# EAGLE design 32u4_pocket (EAGLE 7.4.0)
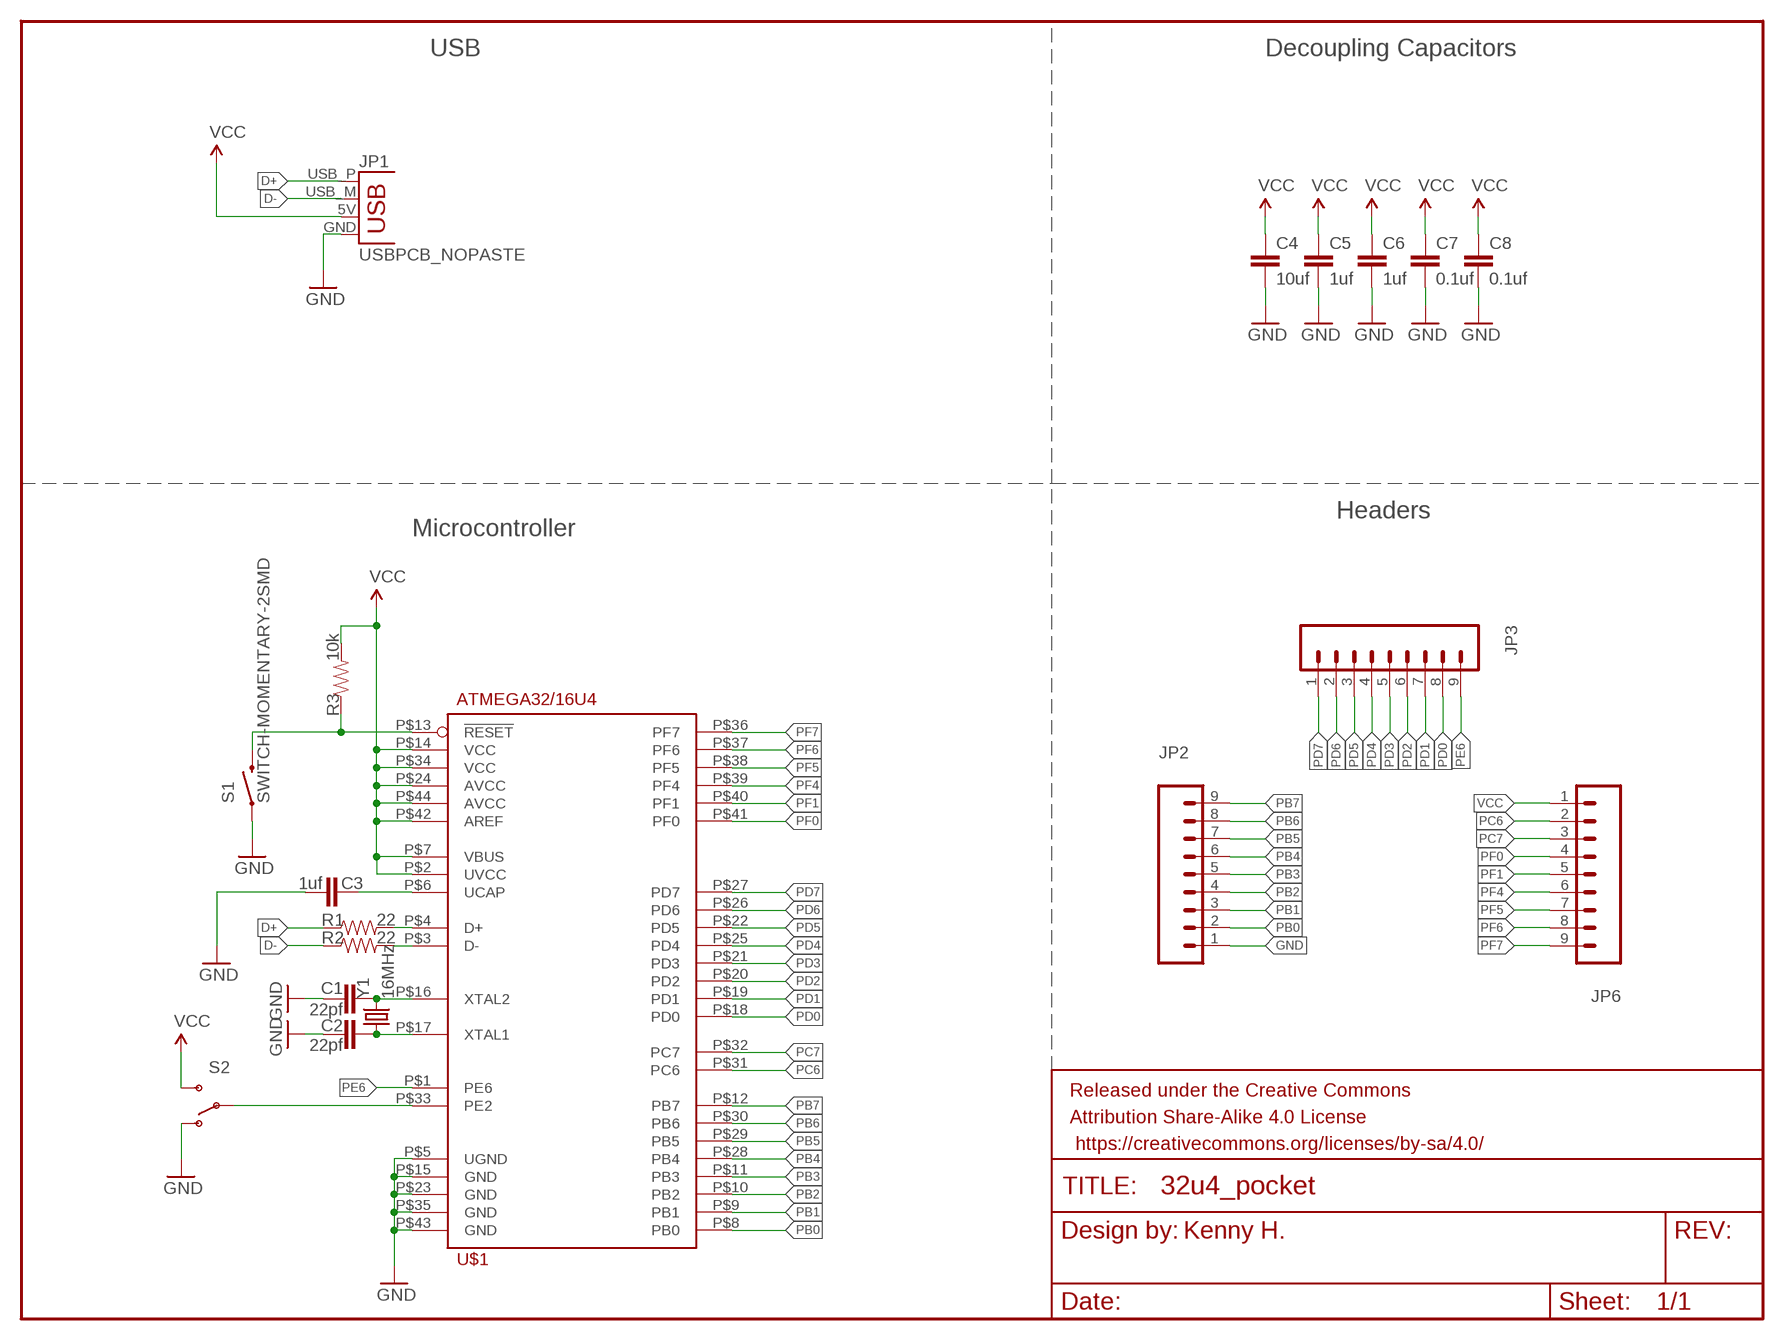
[diagram p0: schematic, sheet 1]

## Parts
C1  22pf  CAP0603-CAP  [0603-CAP]
C2  22pf  CAP0603-CAP  [0603-CAP]
C3  1uf  CAP0603-CAP  [0603-CAP]
C4  10uf  CAP0603-CAP  [0603-CAP]
C5  1uf  CAP0603-CAP  [0603-CAP]
C6  1uf  CAP0603-CAP  [0603-CAP]
C7  0.1uf  CAP0603-CAP  [0603-CAP]
C8  0.1uf  CAP0603-CAP  [0603-CAP]
FRAME1  FRAME-LETTER  [CREATIVE_COMMONS]
JP1  USBPCB_NOPASTE  [USB-A-PCB-NOPASTE]
JP2  M09LOCK-LONGPADS  [1X09_LOCK_LONGPADS]
JP3  M09LOCK-LONGPADS  [1X09_LOCK_LONGPADS]
JP6  M09LOCK-LONGPADS  [1X09_LOCK_LONGPADS]
R1  22  RESISTOR0603-RES  [0603-RES]
R2  22  RESISTOR0603-RES  [0603-RES]
R3  10k  RESISTOR0603-RES  [0603-RES]
S1  SWITCH-MOMENTARY-2SMD  [TACTILE-SWITCH-SMD]
S2  SWITCH-SPDT-SMD-A  [SWITCH-SPST-SMD-A]
U$1  ATMEGA32/16U4  [TQFP_44_0.8MM]
Y1  16MHz  CRYSTALHC49US  [HC49US]

## Nets
D+: JP1.USB_P(D+) R1.1
D-: JP1.USB_M(D-) R2.1
GND: C1.1 C2.1 C3.2 C4.2 C5.2 C6.2 C7.2 C8.2 JP1.GND JP2.1 S1.1 S2.1(O) U$1.P$5(UGND) U$1.P$15(GND) U$1.P$23(GND) U$1.P$35(GND) U$1.P$43(GND)
N$1: R3.1 S1.3 U$1.P$13(!RESET)
N$2: S2.2(P) U$1.P$33(PE2)
N$3: C2.2 U$1.P$17(XTAL1) Y1.1
N$4: C1.2 U$1.P$16(XTAL2) Y1.2
N$7: C3.1 U$1.P$6(UCAP)
N$23: R1.2 U$1.P$4(D+)
N$24: R2.2 U$1.P$3(D-)
PB0: JP2.2 U$1.P$8(PB0)
PB1: JP2.3 U$1.P$9(PB1)
PB2: JP2.4 U$1.P$10(PB2)
PB3: JP2.5 U$1.P$11(PB3)
PB4: JP2.6 U$1.P$28(PB4)
PB5: JP2.7 U$1.P$29(PB5)
PB6: JP2.8 U$1.P$30(PB6)
PB7: JP2.9 U$1.P$12(PB7)
PC6: JP6.2 U$1.P$31(PC6)
PC7: JP6.3 U$1.P$32(PC7)
PD0: JP3.8 U$1.P$18(PD0)
PD1: JP3.7 U$1.P$19(PD1)
PD2: JP3.6 U$1.P$20(PD2)
PD3: JP3.5 U$1.P$21(PD3)
PD4: JP3.4 U$1.P$25(PD4)
PD5: JP3.3 U$1.P$22(PD5)
PD6: JP3.2 U$1.P$26(PD6)
PD7: JP3.1 U$1.P$27(PD7)
PE6: JP3.9 U$1.P$1(PE6)
PF0: JP6.4 U$1.P$41(PF0)
PF1: JP6.5 U$1.P$40(PF1)
PF4: JP6.6 U$1.P$39(PF4)
PF5: JP6.7 U$1.P$38(PF5)
PF6: JP6.8 U$1.P$37(PF6)
PF7: JP6.9 U$1.P$36(PF7)
VCC: C4.1 C5.1 C6.1 C7.1 C8.1 JP1.5V(VBUS) JP6.1 R3.2 S2.3(S) U$1.P$2(UVCC) U$1.P$7(VBUS) U$1.P$14(VCC) U$1.P$24(AVCC) U$1.P$34(VCC) U$1.P$42(AREF) U$1.P$44(AVCC)

## Notes on the sheet
- USB | Decoupling Capacitors
- Headers
- Microcontroller
- Kenny H.

## Library data of the parts
C1-C8 = SparkFun-Capacitors:CAP: Capacitor Standard 0603 ceramic capacitor, and 0.1" leaded capacitor.
FRAME1 = SparkFun-Aesthetics:FRAME-LETTER: Schematic Frame Standard 8.5x11 US Letter frame
JP1 = SparkFun-Connectors:USB: USB Connectors USB-B-PTH is fully proven SKU : PRT-00139/CONN-08278 USB-miniB is fully proven SKU : PRT-00587 USB-A-PCB is untested. USB-A-H is throughly reviewed, but untested. Spark Fun Electronics SKU : PRT-00437 USB-B-SMT is throughly reviewed, but untested. Needs silkscreen touching up. USB-A-S has not been used/tested USB-MB-H has not been used/tested USB-MICROB has been used. CONN-09505
JP2 JP3 JP6 = SparkFun-Connectors:M09: Header 9 Standard 9-pin 0.1" header. Use with straight break away headers (SKU : PRT-00116), right angle break away headers (PRT-00553), swiss pins (PRT-00743), machine pins (PRT-00117), and female headers (PRT-00115).
R1-R3 = SparkFun-Passives:RESISTOR: Resistor Basic schematic elements and footprints for 0603, 1206, and PTH resistors.
S1 = SparkFun-Electromechanical:SWITCH-MOMENTARY-2: Various NO switches- pushbuttons, reed, etc; PROD_ID: SWCH-08247
S2 = SparkFun-Electromechanical:SWITCH-SPDT: SPDT Switch Simple slide switch, Spark Fun Electronics SKU : COM-00102 DPDT SMT slide switch, AYZ0202, SWCH-08179
U$1 = SparkFlame-Microcontrollers:ATMEGA32/16U4: ATmega32u4 and 16u4 Atmel's ATmega32u4 and 16u4 -This is Atmel's 32u4 in a TQFP44 package. -Made by Kenny H. -Created for a 32u4 breakout 8-bit microcontroller with 16/32K bytes of ISP flash and USB Controller
Y1 = SparkFun-FreqCtrl:CRYSTAL: Various standard crystals. Proven footprints.

## Board
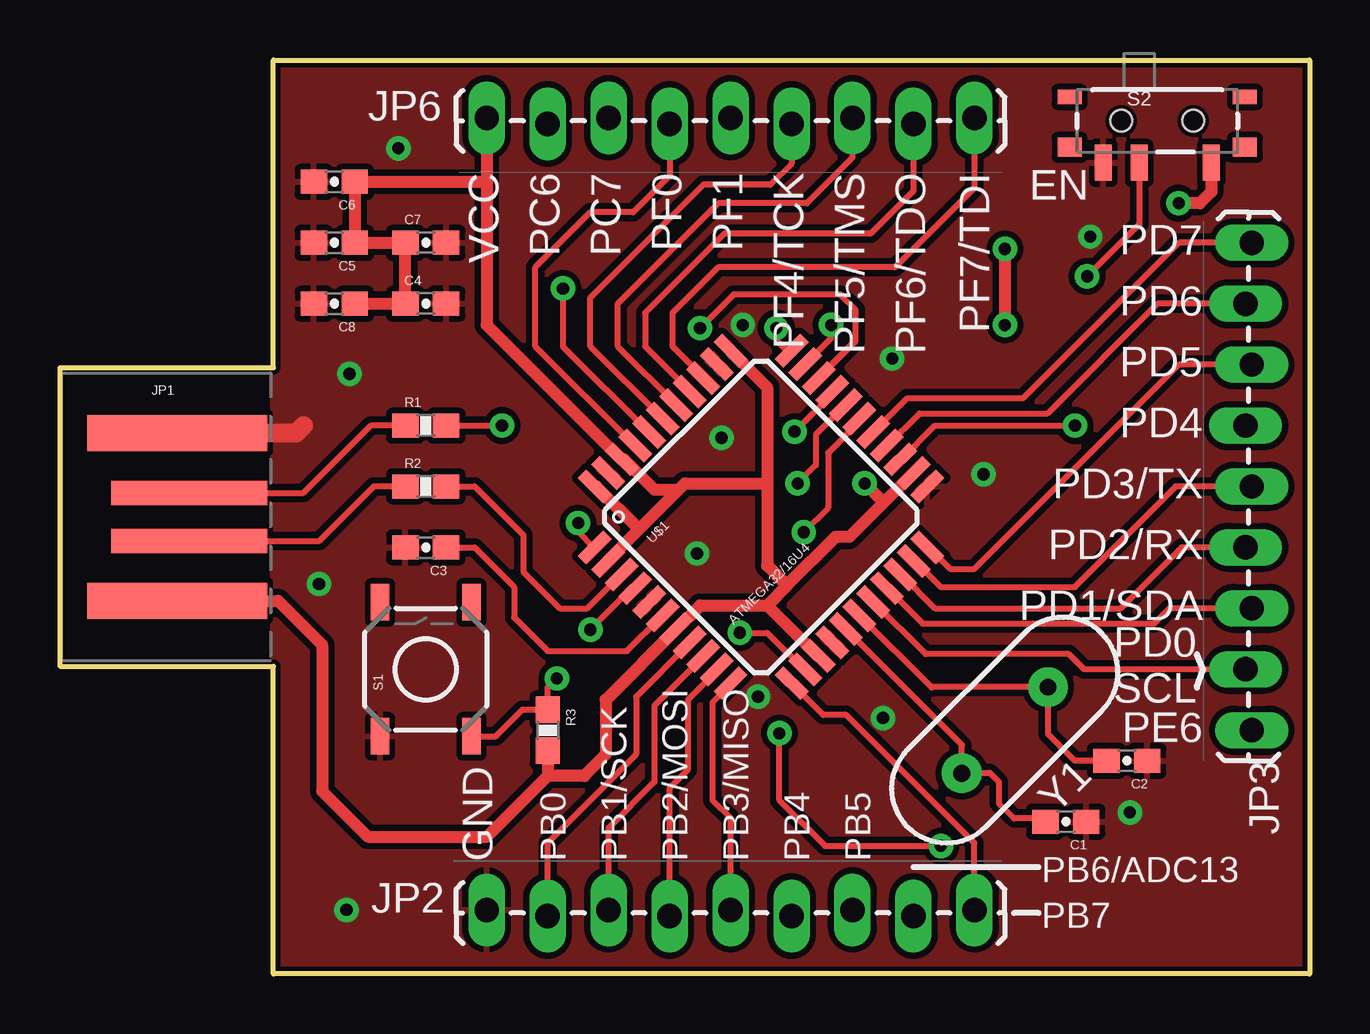
[diagram p1: board, top side]
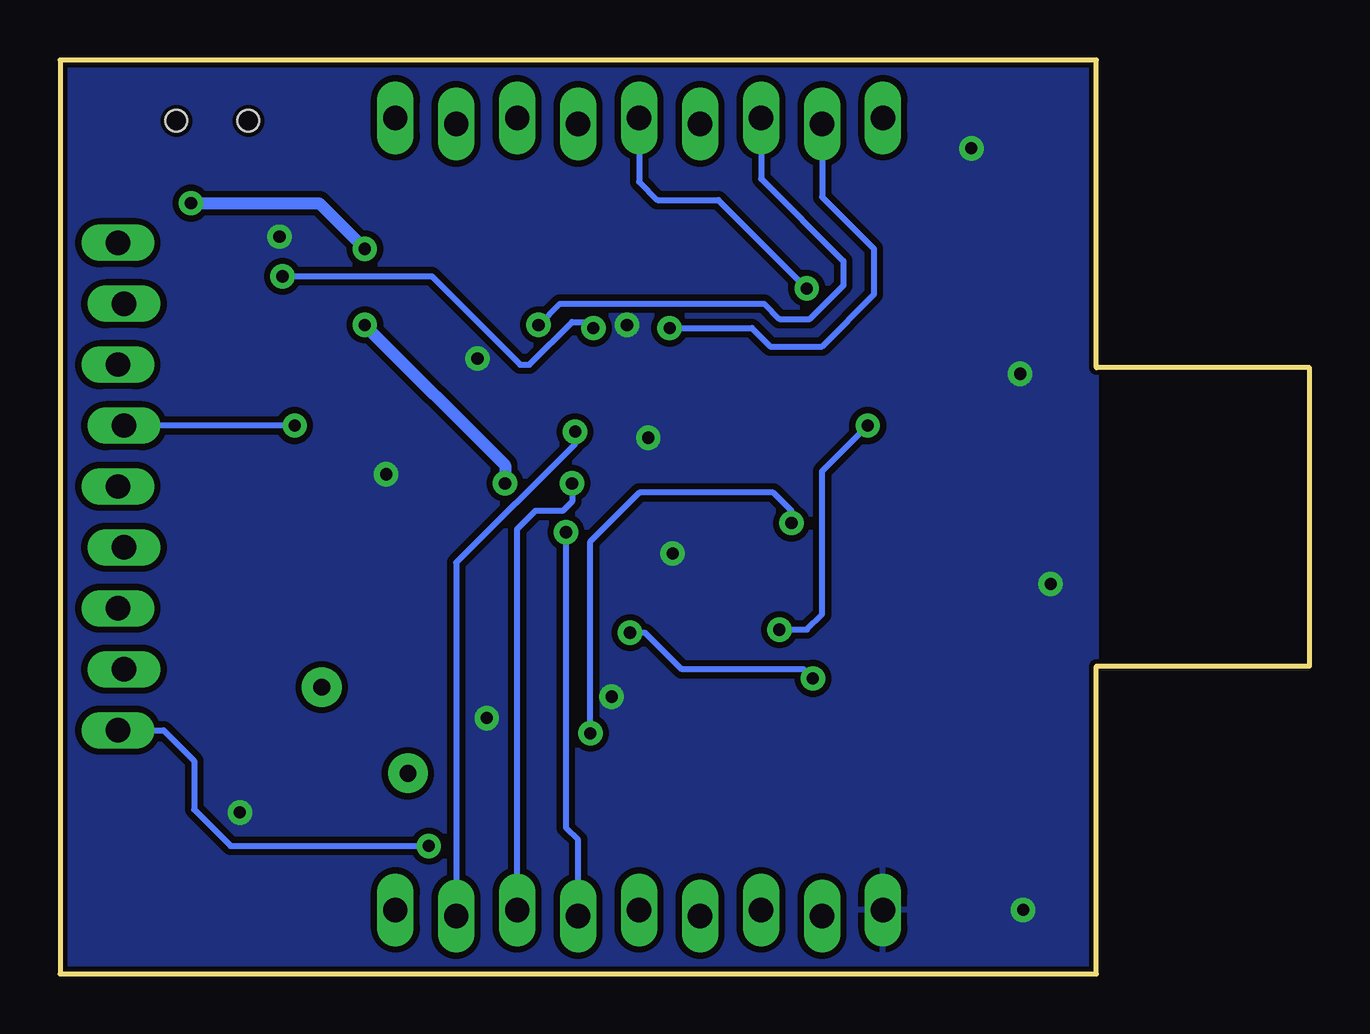
[diagram p2: board, bottom side, seen from below]

Size 52.07 x 38.1 mm. Coordinates in mm from the lower left corner, seen from the top.
Outline: 8.89,25.27 8.89,38.1 52.07,38.1 52.07,0 8.89,0 8.89,12.83 0,12.83 0,25.27 8.89,25.27
Copper layers (1*16): Top 0.035mm / dielectric 1.5mm / Bottom 0.035mm
Design rules "SparkFun-2-layer-STANDARD": minimum track width 10mil, minimum drill 20mil, track to track 10mil, track to pad 8mil, pad to pad 8mil, via to via 10mil, smd to smd 8mil, copper to edge 8mil, drill to drill 8mil, minimum pad ring 10mil, minimum via ring 10mil, stop-mask expansion 4mil, vias tented up to drill 20mil, thermal gap 10mil

### Footprints (pad centres in the part's own frame; a part is rotated, then mirrored left to right if it is on the bottom)
0603-CAP = smd 1.1 x 1: 1 -0.85,0; 2 0.85,0
USB-A-PCB-NOPASTE = smd 7.5 x 1.5: 5V -0.2,-3.5; GND -0.2,3.5 | smd 6.5 x 1: USB_M 0.3,-1; USB_P 0.3,1
1X09_LOCK_LONGPADS = drill 1.016 long: 1 0,0.127; 2 2.54,-0.127; 3 5.08,0.127; 4 7.62,-0.127; 5 10.16,0.127; 6 12.7,-0.127; 7 15.24,0.127; 8 17.78,-0.127; 9 20.32,0.127
0603-RES = smd 1.1 x 1: 1 -0.85,0; 2 0.85,0
TACTILE-SWITCH-SMD = smd 1.524 x 0.762: 1 -2.794,1.905; 2 2.794,1.905; 3 -2.794,-1.905; 4 2.794,-1.905
SWITCH-SPST-SMD-A = smd 0.7 x 1.5: 1 -2.25,-1.75; 2 -0.75,-1.75; 3 2.25,-1.75 | smd 1 x 0.6: GND1 -3.65,1; GND3 3.65,1 | smd 1 x 0.8: GND2 -3.65,-1.1; GND4 3.65,-1.1 | hole 0.9: -1.5,0; 1.5,0
TQFP_44_0.8MM = smd 1.5 x 0.5: P$1 -5.8,4; P$2 -5.8,3.2; P$3 -5.8,2.4; P$4 -5.8,1.6; P$5 -5.8,0.8; P$6 -5.8,0; P$7 -5.8,-0.8; P$8 -5.8,-1.6; P$9 -5.8,-2.4; P$10 -5.8,-3.2; P$11 -5.8,-4; P$23 5.8,-4; P$24 5.8,-3.2; P$25 5.8,-2.4; P$26 5.8,-1.6; P$27 5.8,-0.8; P$28 5.8,0; P$29 5.8,0.8; P$30 5.8,1.6; P$31 5.8,2.4; P$32 5.8,3.2; P$33 5.8,4 | smd 0.5 x 1.5: P$12 -4,-5.8; P$13 -3.2,-5.8; P$14 -2.4,-5.8; P$15 -1.6,-5.8; P$16 -0.8,-5.8; P$17 0,-5.8; P$18 0.8,-5.8; P$19 1.6,-5.8; P$20 2.4,-5.8; P$21 3.2,-5.8; P$22 4,-5.8; P$34 4,5.8; P$35 3.2,5.8; P$36 2.4,5.8; P$37 1.6,5.8; P$38 0.8,5.8; P$39 0,5.8; P$40 -0.8,5.8; P$41 -1.6,5.8; P$42 -2.4,5.8; P$43 -3.2,5.8; P$44 -4,5.8
HC49US = drill 0.7 pad 1.651: 1 -2.54,0; 2 2.54,0

### Placement (x,y rotation side)
C1  41.91,6.35 180 top
C2  44.45,8.89 180 top
C3  15.24,17.78 180 top
C4  15.24,27.94 0 top
C5  11.43,30.48 180 top
C6  11.43,33.02 180 top
C7  15.24,30.48 0 top
C8  11.43,27.94 180 top
FRAME1  22.86,-7.62 0 top  (outside the outline)
JP1  5.08,19.05 0 top
JP2  17.78,2.54 0 top
JP3  49.53,30.48 270 top
JP6  17.78,35.56 0 top
R1  15.24,22.86 0 top
R2  15.24,20.32 0 top
R3  20.32,10.16 270 top
S1  15.24,12.7 90 top
S2  45.72,35.56 0 top
U$1  29.21,19.05 45 top
Y1  39.37,10.16 225 top

### Tracks (layer width: path | path; a pad name or v marks a point on that pad's centre or on a via)
D+
  Top 0.254: JP1.USB_P 10.14,20.05 12.95,22.86 R1.1
D-
  Top 0.254: JP1.USB_M 10.81,18.05 13.08,20.32 R2.1
GND  (via drill 0.51)
  Top 0.762: JP1.GND 9.85,22.55 10.16,22.86
  other vias: 12.06,25.02 14.1,34.42 38.48,20.83 42.93,30.73 34.67,25.65 44.58,6.73 29.08,11.56 11.94,2.67 26.54,17.53 28.45,27.05 27.56,22.35 34.29,10.67 10.79,16.26
  pour Bottom: 8.89,12.83 8.89,25.27 8.89,38.1 52.07,38.1 52.07,0 8.89,0
  pour Top: 8.89,12.83 8.89,25.27 8.89,38.1 52.07,38.1 52.07,0 8.89,0
N$1  (via drill 0.51)
  Top 0.254: U$1.P$13 31,12.69 29.46,14.22 v28.32,14.22 | v20.7,12.32 20.32,11.94 R3.1 19.27,11.01 18.16,9.91 S1.3
  Bottom 0.254: v28.32,14.22 27.69,14.22 26.16,12.7 21.08,12.7 v20.7,12.32
N$2  (via drill 0.51)
  Top 0.254: S2.2 44.97,31.25 v42.8,29.08 | v29.84,26.92 29.84,26.42 30.28,25.98 U$1.P$33
  Bottom 0.254: v42.8,29.08 36.58,29.08 32.89,25.4 32.51,25.4 30.73,27.18 30.1,27.18 v29.84,26.92
N$3
  Top 0.254: U$1.P$17 | U$1.P$17 36.3,11.96 | 36.3,11.96 36.32,11.94 | 36.3,11.96 Y1.1 41.17,10.02 42.29,8.89 C2.2
N$4
  Top 0.254: U$1.P$16 37.57,9.54 | 37.57,9.54 37.59,9.53 | 37.57,9.54 Y1.2 37.59,8.38 38.73,8.38 39.12,8 39.12,7.11 39.75,6.48 40.93,6.48 C1.2
N$7
  Top 0.254: C3.1 17.27,17.78 18.92,16.13 18.92,14.86 20.32,13.46 23.62,13.46 U$1.P$6
N$23  (via drill 0.51)
  Top 0.254: U$1.P$4 23.83,16.08 v22.1,14.35 | R1.2 v18.41,22.86
  Bottom 0.254: v22.1,14.35 20.95,14.35 20.32,14.99 20.32,20.95 v18.41,22.86
N$24
  Top 0.254: R2.2 17.27,20.32 19.3,18.29 19.3,16.76 20.83,15.24 21.97,15.24 23.38,16.65 U$1.P$3
PB0
  Top 0.254: JP2.2 20.32,5.46 24,9.14 24,11.56 26.24,13.79 U$1.P$8
PB1
  Top 0.254: U$1.P$9 26.81,13.22 24.77,11.18 24.77,8 22.86,6.1 JP2.3
PB2
  Top 0.254: JP2.4 25.4,7.75 26.16,8.51 26.16,11.43 27.37,12.64 U$1.P$10
PB3
  Top 0.254: U$1.P$11 27.94,12.06 27.18,11.3 27.18,7.24 27.94,6.48 JP2.5
PB4  (via drill 0.51)
  Top 0.254: U$1.P$28 33.31,23.02 32,21.72 32,19.43 v30.99,18.41
  Bottom 0.254: v30.99,18.41 30.99,6.1 30.48,5.59 JP2.6
PB5  (via drill 0.51)
  Top 0.254: U$1.P$29 32.75,23.6 32.62,23.6 31.5,22.48 31.5,21.21 v30.73,20.45
  Bottom 0.254: JP2.7 33.02,18.54 32.26,19.3 31.11,19.3 30.73,19.69 v30.73,20.45
PB6  (via drill 0.51)
  Top 0.254: U$1.P$30 32.18,24.18 v30.61,22.61
  Bottom 0.254: JP2.8 35.56,17.15 30.61,22.1 v30.61,22.61
PB7
  Top 0.254: 30.55,12.12 U$1.P$12 31.81,10.79 32.77,10.79 38.1,5.46 JP2.9
PC6  (via drill 0.51)
  Top 0.254: 33.15,26.38 U$1.P$31 31.61,24.88 33.15,26.42 33.15,27.69 32.51,28.32 28.07,28.32 v26.67,26.92
  Bottom 0.254: JP6.2 20.32,32.39 18.16,30.23 18.16,28.32 20.32,26.16 22.48,26.16 23.24,26.92 v26.67,26.92
PC7  (via drill 0.51)
  Top 0.254: U$1.P$32 32.13,26.5 v32.13,27.05
  Bottom 0.254: JP6.3 22.86,33.15 19.43,29.72 19.43,28.7 20.83,27.3 22.1,27.3 22.73,27.94 31.24,27.94 v32.13,27.05
PD0
  Top 0.254: JP3.8 42.67,12.7 42.04,13.33 36.07,13.33 U$1.P$18
PD1
  Top 0.254: U$1.P$19 34.47,16.08 35.94,14.6 45.59,14.6 46.23,15.24 JP3.7
PD2
  Top 0.254: U$1.P$20 35.04,16.65 36.45,15.24 44.2,15.24 46.61,17.65 46.74,17.78 JP3.6
PD3
  Top 0.254: U$1.P$21 35.62,17.21 36.7,16.13 42.29,16.13 46.48,20.32 JP3.5
PD4  (via drill 0.51)
  Top 0.254: U$1.P$25 35.04,21.45 36.45,22.86 v42.29,22.86
  Bottom 0.254: v42.29,22.86 JP3.4
PD5
  Top 0.254: U$1.P$22 36.2,17.78 37.08,16.89 38.1,16.89 46.61,25.4 JP3.3
PD6
  Top 0.254: U$1.P$26 34.47,22.02 35.81,23.37 41.15,23.37 45.72,27.94 JP3.2
PD7
  Top 0.254: U$1.P$27 35.31,24 40.13,24 46.61,30.48 JP3.1
PE6  (via drill 0.51)
  Top 0.254: U$1.P$1 22.23,17.78 21.59,18.41 v21.59,18.8 | v29.97,10.03 29.97,7.24 31.88,5.33 v36.7,5.33
  Bottom 0.254: JP3.9 47.75,10.16 46.48,8.89 46.48,6.86 44.96,5.33 v36.7,5.33 | v21.59,18.8 21.59,19.3 22.35,20.07 27.94,20.07 29.97,18.03 v29.97,10.03
PF0
  Top 0.254: U$1.P$41 23.95,22.02 19.81,26.16 19.81,29.46 22.1,31.75 23.88,31.75 25.4,33.27 JP6.4
PF1  (via drill 0.51)
  Top 0.254: U$1.P$40 20.95,26.16 v20.95,28.58
  Bottom 0.254: JP6.5 27.94,33.02 27.18,32.26 24.64,32.26 v20.95,28.58
PF4
  Top 0.254: U$1.P$39 | U$1.P$39 22.1,26.16 22.1,28.19 26.8,32.89 29.59,32.89 30.48,33.78 JP6.6
PF5
  Top 0.254: U$1.P$38 23.24,26.16 23.24,27.94 27.43,32.13 31.11,32.13 33.02,34.04 JP6.7
PF6
  Top 0.254: U$1.P$37 26.24,24.31 24.38,26.16 24.38,27.56 27.69,30.86 33.78,30.86 35.56,32.64 JP6.8
PF7
  Top 0.254: U$1.P$36 26.81,24.88 25.53,26.16 25.53,27.56 27.43,29.46 34.8,29.46 38.1,32.77 JP6.9
VCC  (via drill 0.51)
  Top 0.508: R3.2 20.32,8.26 | 20.32,8.26 17.78,5.71 12.83,5.71 10.92,7.62 10.92,13.72 9.09,15.55 JP1.5V | 20.32,8.26 21.84,8.26 22.73,9.14 22.73,11.43 U$1.P$7 25.69,14.38 26.67,15.37 29.46,15.37 | U$1.P$14 31.58,13.25 29.46,15.37 | U$1.P$24 35.56,20.89 34.32,19.65 | 34.32,19.65 32.89,18.23 32.32,18.23 30.29,16.19 | 30.29,16.19 29.46,15.37 | U$1.P$44 22.35,20.32 24.13,18.54 | U$1.P$2 22.85,17.26 24.13,18.54 | 25.78,20.19 26.04,20.45 29.46,20.45 | 25.78,20.19 24.77,20.19 23.5,21.45 U$1.P$42 23.38,21.45 17.78,27.05 17.78,33.02 | 30.29,16.19 29.46,17.02 29.46,20.45 | 24.13,18.54 25.78,20.19 | U$1.P$34 29.46,24.45 29.46,20.45 | JP6.1 17.78,33.02 | C8.1 C4.1 C7.1 C5.1 C6.1 17.78,33.02 | S2.3 47.97,32.6 47.5,32.13 v46.61,32.13 | v33.53,20.45 34.32,19.65 | v39.37,30.23 v39.37,27.05
  Bottom 0.508: v39.37,30.23 41.27,32.13 v46.61,32.13 | v39.37,27.05 33.53,21.21 v33.53,20.45

### Text on the board
tPlace: VCC | PC6 | PC7 | PF0 | PF1 | PF4/TCK | PF5/TMS | PF6/TDO | PF7/TDI | EN | PD7 | PD6 | PD5 | PD4 | PD3/TX | PD2/RX | PD1/SDA | PD0 / SCL | PE6 | GND | PB0 | PB1/SCK | PB2/MOSI | PB3/MISO | PB4 | PB5 | PB6/ADC13 | PB7
tDocu: Kenny H.